# Altium project XFM2-BASE-BOARD.PrjPcb
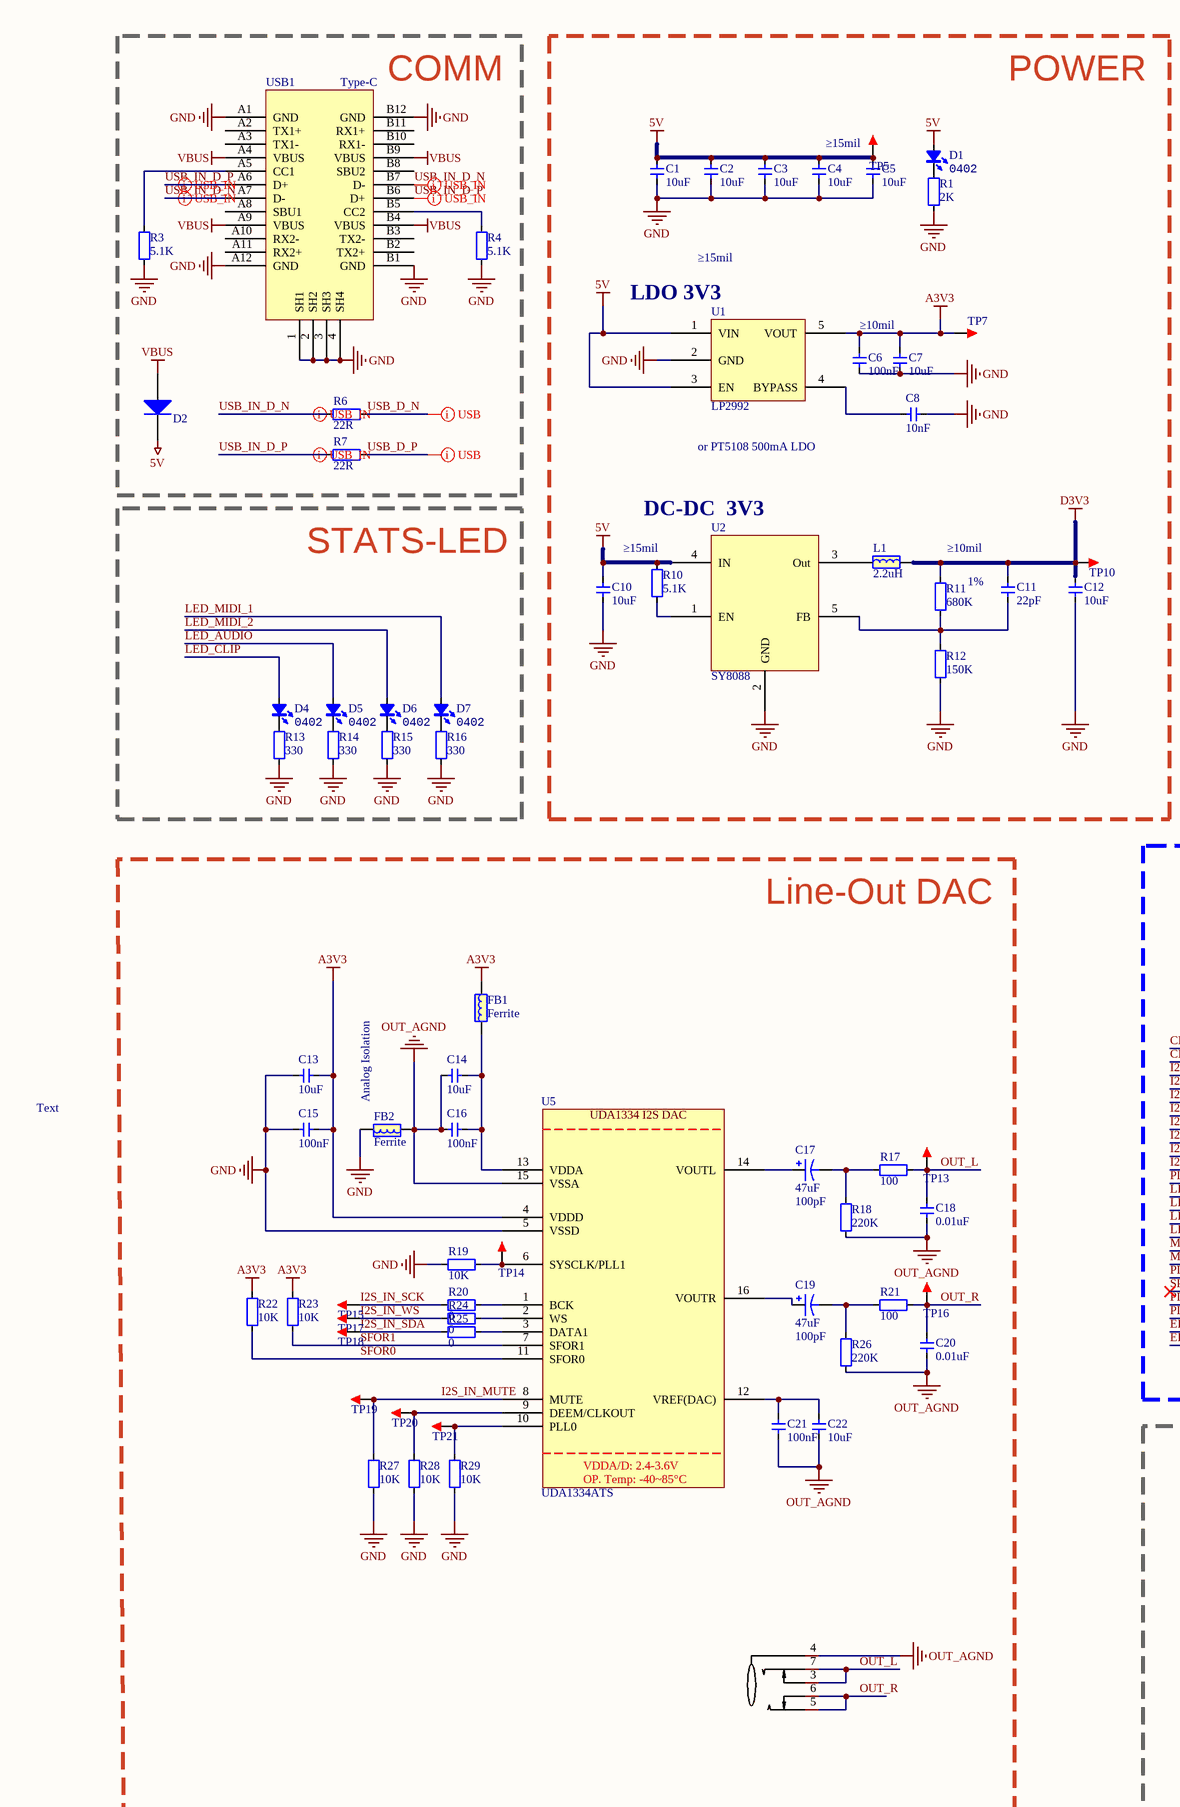
[diagram p0: Sheet1.SchDoc, left]
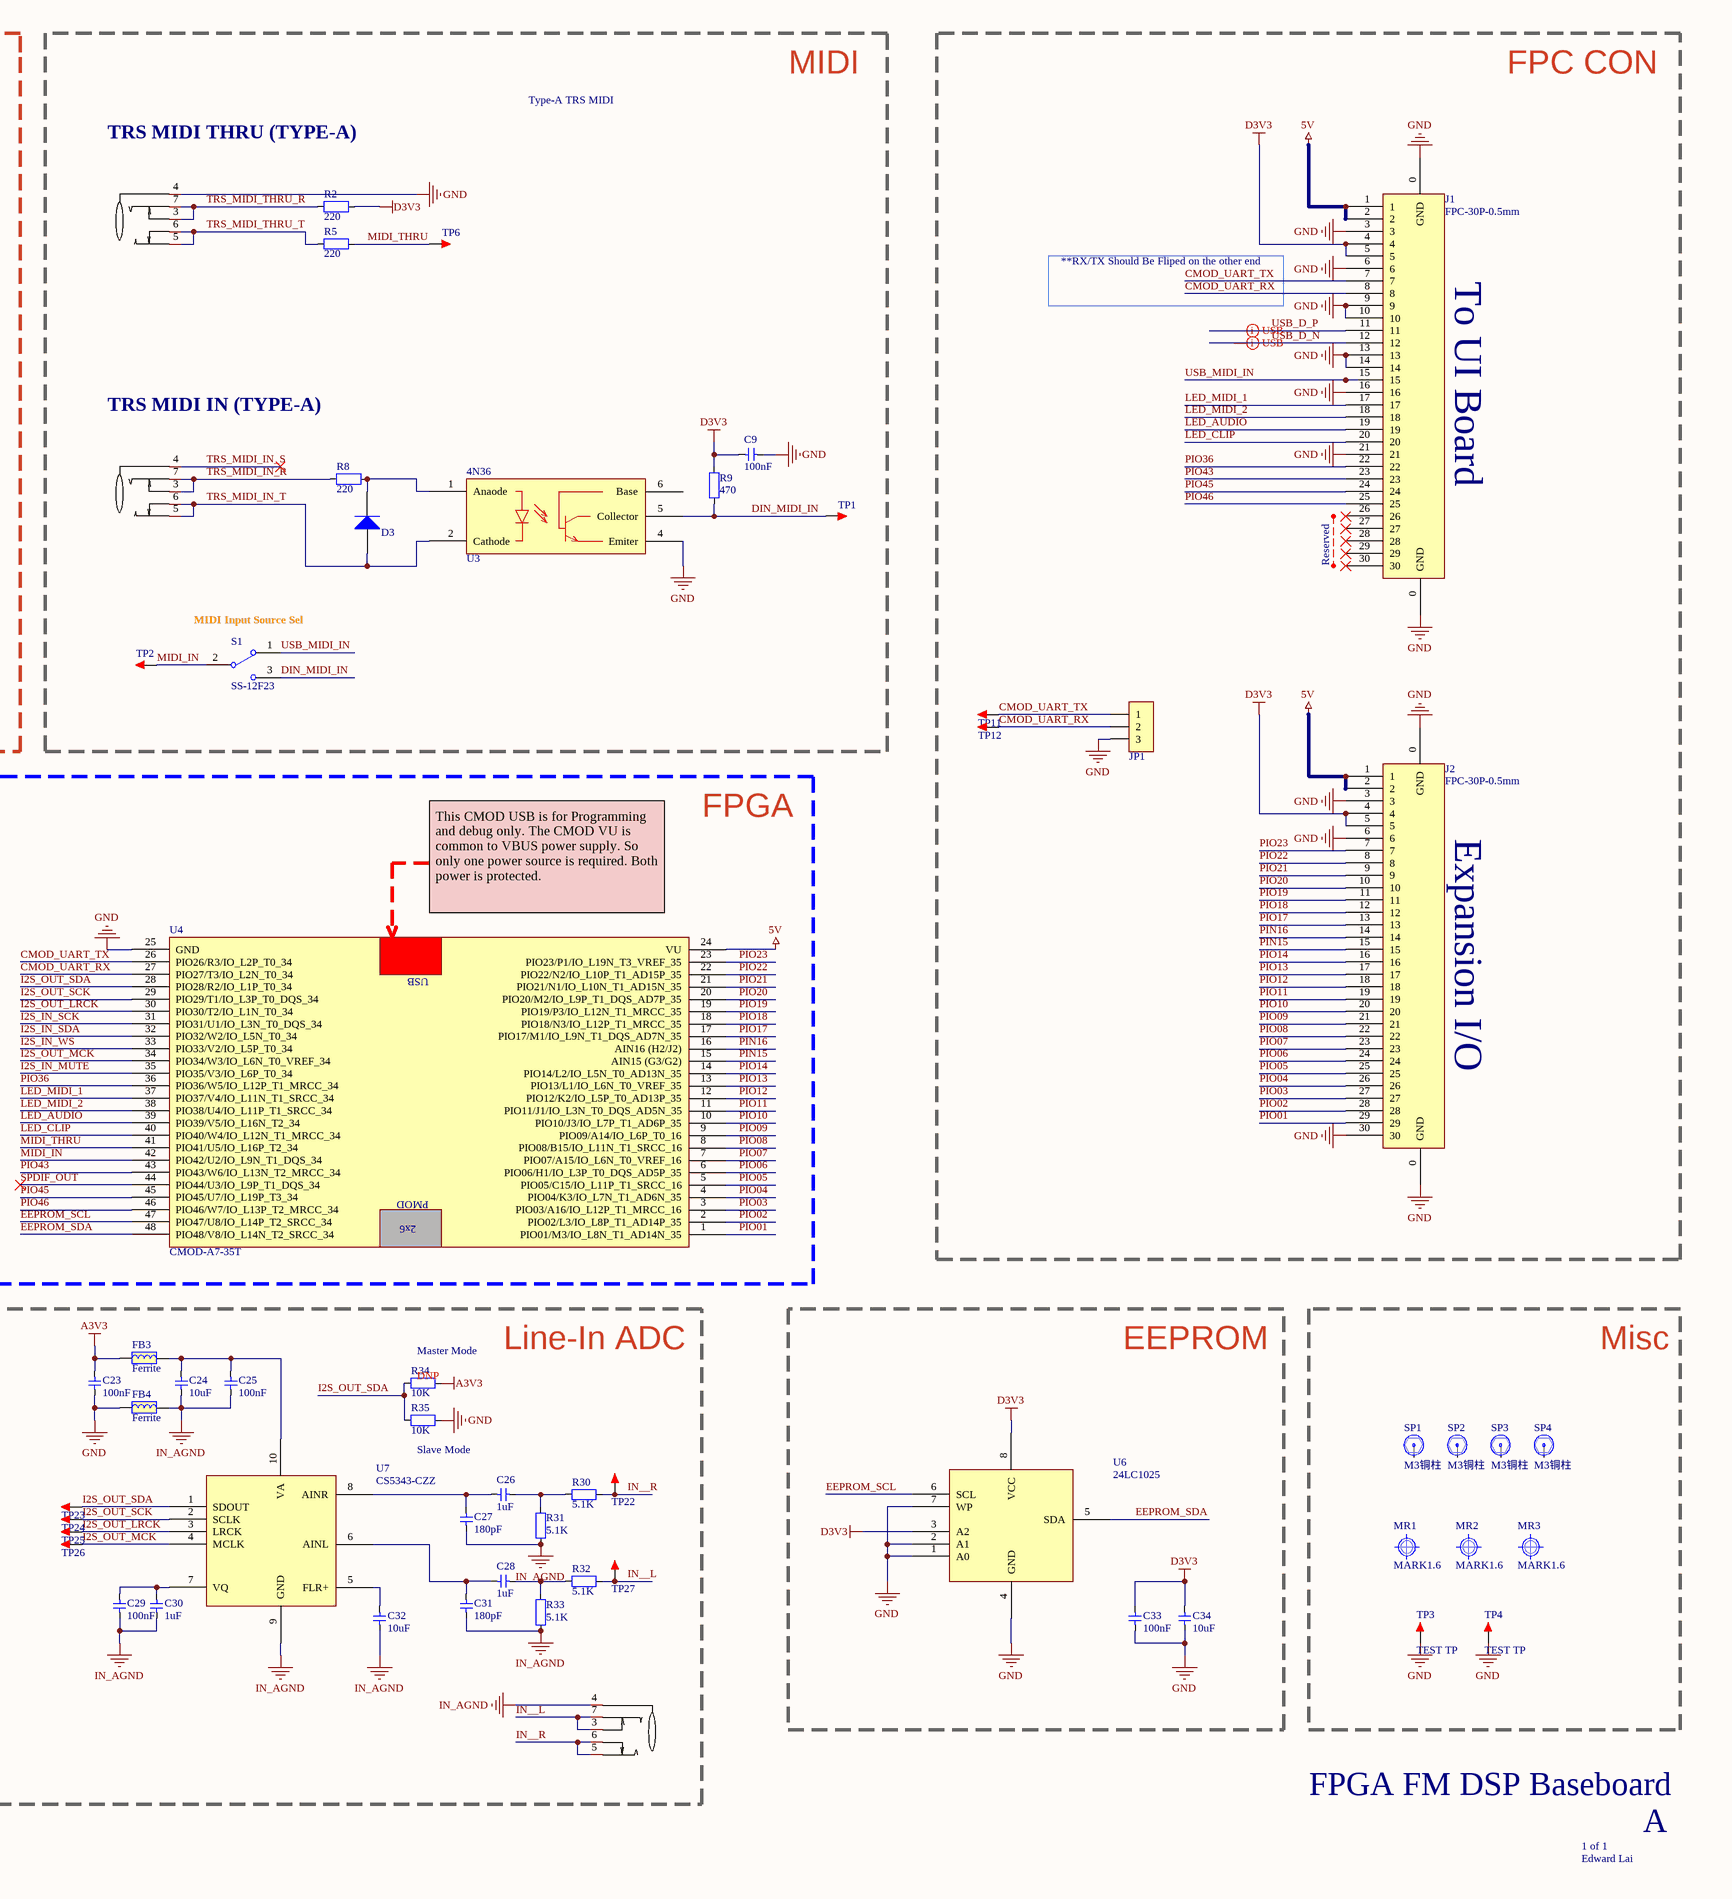
[diagram p1: Sheet1.SchDoc, right]
1 sheet, 129 parts. Net scope: global (net labels, ports and power ports of the same name join across sheets).
Board file: BaseBoard.PcbDoc

## Sheet Sheet1.SchDoc
size A2

### Parts
C1  10uF  [C0402_L]
C2  10uF  [C0402_L]
C3  10uF  [C0402_L]
C4  10uF  [C0402_L]
C5  10uF  [C0402_L]
C6  100nF  [C0402_L]
C7  10uF  [C0402_L]
C8  10nF  [C0402_L]
C9  100nF  [C0402_L]
C10  10uF  [C0402_L]
C11  22pF  [C0402_L]
C12  10uF  [C0402_L]
C13  10uF  [C0402_L]
C14  10uF  [C0402_L]
C15  100nF  [C0402_L]
C16  100nF  [C0402_L]
C17  47uF  value 100pF  [CT 5*6 - B]
C18  0.01uF  [C0603_L]
C19  47uF  value 100pF  [CT 5*6 - B]
C20  0.01uF  [C0603_L]
C21  100nF  [C0402_L]
C22  10uF  [C0402_L]
C23  100nF  [C0402_L]
C24  10uF  [C0402_L]
C25  100nF  [C0402_L]
C26  1uF  [C0402_L]
C27  180pF  [C0402_L]
C28  1uF  [C0402_L]
C29  100nF  [C0402_L]
C30  1uF  [C0402_L]
C31  180pF  [C0402_L]
C32  10uF  [C0402_L]
C33  100nF  [C0402_L]
C34  10uF  [C0402_L]
CN1  PJ-328-5A  [AUDIO-SMD_PJ-328-5A]  (value not drawn)
CN2  PJ-328-5A  [AUDIO-SMD_PJ-328-5A]  (value not drawn)
CN3  PJ-328-5A  [AUDIO-SMD_PJ-328-5A]  (value not drawn)
CN4  PJ-328-5A  [AUDIO-SMD_PJ-328-5A]  (value not drawn)
D1  Type: 0402  [LED0603_R]  (hidden comment: color?)
D2  二极管-5B5819WS  [SOD-323]  (value not drawn)
D3  Diode  [SOD-523]  (value not drawn)
D4  Type: 0402  [LED0603_R]  (hidden comment: color?)
D5  Type: 0402  [LED0603_G]  (hidden comment: color?)
D6  Type: 0402  [LED0603_W]  (hidden comment: color?)
D7  Type: 0402  [LED0603_W]  (hidden comment: color?)
FB1  Ferrite  [L0402]
FB2  Ferrite  [L0402]
FB3  Ferrite  [L0402]
FB4  Ferrite  [L0402]
J1  FPC-30P-0.5mm  [FPC0.5-WT-30P]
J2  FPC-30P-0.5mm  [FPC0.5-WT-30P]
JP1  HDR-1X3  [XH2.54-LS-3P]  (value not drawn)
L1  2.2uH  [IND-201612]
MR1  MARK1.6  [Mark 1.6]  (graphical)
MR2  MARK1.6  [Mark 1.6]  (graphical)
MR3  MARK1.6  [Mark 1.6]  (graphical)
R1  2K  [R0402_L]
R2  220  [R0402_L]
R3  5.1K  [R0402_L]
R4  5.1K  [R0402_L]
R5  220  [R0402_L]
R6  22R  [R0402_L]
R7  22R  [R0402_L]
R8  220  [R0402_L]
R9  470  [R0402_L]
R10  5.1K  [R0402_L]
R11  680K  Parameter 1: 1%  [R0402_L]
R12  150K  [R0402_L]
R13  330  [R0402_L]
R14  330  [R0402_L]
R15  330  [R0402_L]
R16  330  [R0402_L]
R17  100  [R0603_L]
R18  220K  [R0603_L]
R19  10K  [R0402_L]
R20  0  [R0402_L]
R21  100  [R0603_L]
R22  10K  [R0402_L]
R23  10K  [R0402_L]
R24  0  [R0402_L]
R25  0  [R0402_L]
R26  220K  [R0603_L]
R27  10K  [R0402_L]
R28  10K  [R0402_L]
R29  10K  [R0402_L]
R30  5.1K  [R0402_L]
R31  5.1K  [R0402_L]
R32  5.1K  [R0402_L]
R33  5.1K  [R0402_L]
R34  10K  [R0402_L]  (net tie, no BOM)
R35  10K  [R0402_L]  (net tie)
S1  SS-12F23  [MSK-12C01-07]
SP1  M3铜柱  [M3x8_N]  (graphical)
SP2  M3铜柱  [M3x8_N]  (graphical)
SP3  M3铜柱  [M3x8_N]  (graphical)
SP4  M3铜柱  [M3x8_N]  (graphical)
TP1  DIN_MIDI_IN  [TEST 1.2]  (value not drawn)
TP2  MIDI_IN  [TEST 1.2]  (value not drawn)
TP3  TEST TP  [TEST 1.2]
TP4  TEST TP  [TEST 1.2]
TP5  DIN_MIDI_IN  [TEST 1.2]  (value not drawn)
TP6  DIN_MIDI_IN  [TEST 1.2]  (value not drawn)
TP7  DIN_MIDI_IN  [TEST 1.2]  (value not drawn)
TP10  DIN_MIDI_IN  [TEST 1.2]  (value not drawn)
TP11  DIN_MIDI_IN  [TEST 1.2]  (value not drawn)
TP12  DIN_MIDI_IN  [TEST 1.2]  (value not drawn)
TP13  DIN_MIDI_IN  [TEST 1.2]  (value not drawn)
TP14  DIN_MIDI_IN  [TEST 1.2]  (value not drawn)
TP15  DIN_MIDI_IN  [TEST 1.2]  (value not drawn)
TP16  DIN_MIDI_IN  [TEST 1.2]  (value not drawn)
TP17  DIN_MIDI_IN  [TEST 1.2]  (value not drawn)
TP18  DIN_MIDI_IN  [TEST 1.2]  (value not drawn)
TP19  DIN_MIDI_IN  [TEST 1.2]  (value not drawn)
TP20  DIN_MIDI_IN  [TEST 1.2]  (value not drawn)
TP21  DIN_MIDI_IN  [TEST 1.2]  (value not drawn)
TP22  DIN_MIDI_IN  [TEST 1.2]  (value not drawn)
TP23  DIN_MIDI_IN  [TEST 1.2]  (value not drawn)
TP24  DIN_MIDI_IN  [TEST 1.2]  (value not drawn)
TP25  DIN_MIDI_IN  [TEST 1.2]  (value not drawn)
TP26  DIN_MIDI_IN  [TEST 1.2]  (value not drawn)
TP27  DIN_MIDI_IN  [TEST 1.2]  (value not drawn)
U1  LP2992  [SOT23-5M]
U2  SY8088  [SOT23-5]
U3  4N36  [OPTOCOUPLER_H11F3SR2M]
U4  CMOD-A7-35T  [DIP48]
U5  UDA1334ATS  [SSOP16]
U6  24LC1025  [SOIC-8]
U7  CS5343-CZZ  [MSOP10_M]
USB1  Type-C  [Type-C-TOP]

### Blocks framed on the sheet
COMM: D2 R3 R4 R6 R7 USB1
POWER: C1-C8 C10-C12 D1 L1 R1 R10-R12 TP5 TP7 TP10 U1 U2
MIDI: C9 CN1 CN2 D3 R2 R5 R8 R9 S1 TP1 TP2 TP6 U3
STATS-LED: D4-D7 R13-R16
FPGA: U4
Line-In ADC: C23-C32 CN4 FB3 FB4 R30-R35 TP22-TP27 U7
EEPROM: C33 C34 U6
Misc: MR1-MR3 SP1-SP4 TP3 TP4

### Nets
5V: C1.2 C2.2 C3.2 C4.2 C5.2 C10.2 D1.1(A) D2.2(K) J1.1 J1.2 J2.1 J2.2 R10.1 TP5.1 U1.1(VIN) U1.3(EN) U2.4(IN) U4.24(VU)
A3V3: C6.2 C7.2 C13.1 C15.1 C23.2 FB1.2 FB3.1 R22.1 R23.1 R34.1 TP7.1 U1.5(VOUT) U5.4(VDDD)
D3V3: C9.2 C11.2 C12.2 C33.2 C34.2 J1.4 J1.5 J2.4 J2.5 L1.2 R2.2 R9.2 R11.1 TP10.1 U6.3(A2) U6.8(VCC)
GND: C1.1 C2.1 C3.1 C4.1 C5.1 C6.1 C7.1 C8.1 C9.1 C10.1 C12.1 C13.2 C15.2 C23.1 C33.1 C34.1 CN1.4 FB2.2 FB4.1 J1.0(GND) J1.3 J1.6 J1.9 J1.10 J1.13 J1.14 J1.16 J1.21 J2.0(GND) J2.3 J2.6 J2.30 JP1.3 R1.1 R3.2 R4.2 R12.2 R13.1 R14.1 R15.1 R16.1 R19.2 R27.2 R28.2 R29.2 R35.1 TP3.1 TP4.1 U1.2(GND) U2.2(GND) U3.4(Emiter) U4.25(GND) U5.5(VSSD) U6.1(A0) U6.2(A1) U6.4(GND) U6.7(WP) USB1.1(SH1) USB1.2(SH2) USB1.3(SH3) USB1.4(SH4) USB1.A1(GND) USB1.A12(GND) USB1.B1(GND) USB1.B12(GND)
IN_AGND: C24.1 C25.1 C27.1 C29.1 C30.1 C31.1 C32.1 CN4.4 FB4.2 R31.2 R33.2 U7.9(GND)
OUT_AGND: C14.2 C16.2 C18.1 C20.1 C21.1 C22.1 CN3.4 FB2.1 R18.2 R26.2 U5.15(VSSA)
VBUS: D2.1(A) USB1.A4(VBUS) USB1.A9(VBUS) USB1.B4(VBUS) USB1.B9(VBUS)
CMOD_UART_RX: J1.8 JP1.2 TP12.1 U4.27(PIO27/T3/IO_L2N_T0_34)
CMOD_UART_TX: J1.7 JP1.1 TP11.1 U4.26(PIO26/R3/IO_L2P_T0_34)
DIN_MIDI_IN: R9.1 S1.3 TP1.1 U3.5(Collector)
EEPROM_SCL: U4.47(PIO47/U8/IO_L14P_T2_SRCC_34) U6.6(SCL)
EEPROM_SDA: U4.48(PIO48/V8/IO_L14N_T2_SRCC_34) U6.5(SDA)
I2S_IN_MUTE: R27.1 TP19.1 U4.35(PIO35/V3/IO_L6P_T0_34) U5.8(MUTE)
I2S_IN_SCK: R20.1 TP15.1 U4.31(PIO31/U1/IO_L3N_T0_DQS_34)
I2S_IN_SDA: R25.1 TP18.1 U4.32(PIO32/W2/IO_L5N_T0_34)
I2S_IN_WS: R24.1 TP17.1 U4.33(PIO33/V2/IO_L5P_T0_34)
I2S_OUT_LRCK: TP25.1 U4.30(PIO30/T2/IO_L1N_T0_34) U7.3(LRCK)
I2S_OUT_MCK: TP26.1 U4.34(PIO34/W3/IO_L6N_T0_VREF_34) U7.4(MCLK)
I2S_OUT_SCK: TP24.1 U4.29(PIO29/T1/IO_L3P_T0_DQS_34) U7.2(SCLK)
I2S_OUT_SDA: R34.2 R35.2 TP23.1 U4.28(PIO28/R2/IO_L1P_T0_34) U7.1(SDOUT)
IN__L: CN4.3 CN4.7 R32.2 TP27.1
IN__R: CN4.5 CN4.6 R30.1 TP22.1
LED_AUDIO: D5.1(A) J1.19 U4.39(PIO39/V5/IO_L16N_T2_34)
LED_CLIP: D4.1(A) J1.20 U4.40(PIO40/W4/IO_L12N_T1_MRCC_34)
LED_MIDI_1: D7.1(A) J1.17 U4.37(PIO37/V4/IO_L11N_T1_SRCC_34)
LED_MIDI_2: D6.1(A) J1.18 U4.38(PIO38/U4/IO_L11P_T1_SRCC_34)
MIDI_IN: S1.2 TP2.1 U4.42(PIO42/U2/IO_L9N_T1_DQS_34)
MIDI_THRU: R5.2 TP6.1 U4.41(PIO41/U5/IO_L16P_T2_34)
OUT_L: C18.2 CN3.3 CN3.7 R17.1 TP13.1
OUT_R: C20.2 CN3.5 CN3.6 R21.1 TP16.1
PIN15: J2.15 U4.15(AIN15_(G3/G2))
PIN16: J2.14 U4.16(AIN16_(H2/J2))
PIO01: J2.29 U4.1(PIO01/M3/IO_L8N_T1_AD14N_35)
PIO02: J2.28 U4.2(PIO02/L3/IO_L8P_T1_AD14P_35)
PIO03: J2.27 U4.3(PIO03/A16/IO_L12P_T1_MRCC_16)
PIO04: J2.26 U4.4(PIO04/K3/IO_L7N_T1_AD6N_35)
PIO05: J2.25 U4.5(PIO05/C15/IO_L11P_T1_SRCC_16)
PIO06: J2.24 U4.6(PIO06/H1/IO_L3P_T0_DQS_AD5P_35)
PIO07: J2.23 U4.7(PIO07/A15/IO_L6N_T0_VREF_16)
PIO08: J2.22 U4.8(PIO08/B15/IO_L11N_T1_SRCC_16)
PIO09: J2.21 U4.9(PIO09/A14/IO_L6P_T0_16)
PIO10: J2.20 U4.10(PIO10/J3/IO_L7P_T1_AD6P_35)
PIO11: J2.19 U4.11(PIO11/J1/IO_L3N_T0_DQS_AD5N_35)
PIO12: J2.18 U4.12(PIO12/K2/IO_L5P_T0_AD13P_35)
PIO13: J2.17 U4.13(PIO13/L1/IO_L6N_T0_VREF_35)
PIO14: J2.16 U4.14(PIO14/L2/IO_L5N_T0_AD13N_35)
PIO17: J2.13 U4.17(PIO17/M1/IO_L9N_T1_DQS_AD7N_35)
PIO18: J2.12 U4.18(PIO18/N3/IO_L12P_T1_MRCC_35)
PIO19: J2.11 U4.19(PIO19/P3/IO_L12N_T1_MRCC_35)
PIO20: J2.10 U4.20(PIO20/M2/IO_L9P_T1_DQS_AD7P_35)
PIO21: J2.9 U4.21(PIO21/N1/IO_L10N_T1_AD15N_35)
PIO22: J2.8 U4.22(PIO22/N2/IO_L10P_T1_AD15P_35)
PIO23: J2.7 U4.23(PIO23/P1/IO_L19N_T3_VREF_35)
PIO36: J1.22 U4.36(PIO36/W5/IO_L12P_T1_MRCC_34)
PIO43: J1.23 U4.43(PIO43/W6/IO_L13N_T2_MRCC_34)
PIO45: J1.24 U4.45(PIO45/U7/IO_L19P_T3_34)
PIO46: J1.25 U4.46(PIO46/W7/IO_L13P_T2_MRCC_34)
SFOR0: R22.2 U5.11(SFOR0)
SFOR1: R23.2 U5.7(SFOR1)
SPDIF_OUT: U4.44(PIO44/U3/IO_L9P_T1_DQS_34)
TRS_MIDI_IN_R: CN2.3 CN2.7 R8.1
TRS_MIDI_IN_S: CN2.4
TRS_MIDI_IN_T: CN2.5 CN2.6 D3.1(A) U3.2(Cathode)
TRS_MIDI_THRU_R: CN1.3 CN1.7 R2.1
TRS_MIDI_THRU_T: CN1.5 CN1.6 R5.1
USB_D_N: J1.12 R6.1
USB_D_P: J1.11 R7.1
USB_IN_D_N: R6.2 USB1.A7(D-) USB1.B7(D-)
USB_IN_D_P: R7.2 USB1.A6(D+) USB1.B6(D+)
USB_MIDI_IN: J1.15 S1.1
NetC8_2: C8.2 U1.4(BYPASS)
NetC11_1: C11.1 R11.2 R12.1 U2.5(FB)
NetC14_1: C14.1 C16.1 FB1.1 U5.13(VDDA)
NetC17_1: C17.1 U5.14(VOUTL)
NetC17_2: C17.2 R17.2 R18.1
NetC19_1: C19.1 U5.16(VOUTR)
NetC19_2: C19.2 R21.2 R26.1
NetC21_2: C21.2 C22.2 U5.12(VREF(DAC))
NetC24_2: C24.2 C25.2 FB3.2 U7.10(VA)
NetC26_1: C26.1 R30.2 R31.1
NetC26_2: C26.2 C27.2 U7.8(AINR)
NetC28_1: C28.1 R32.1 R33.1
NetC28_2: C28.2 C31.2 U7.6(AINL)
NetC29_2: C29.2 C30.2 U7.7(VQ)
NetC32_2: C32.2 U7.5(FLR+)
NetD1_2: D1.2(K) R1.2
NetD3_2: D3.2(K) R8.2 U3.1(Anaode)
NetD4_2: D4.2(K) R13.2
NetD5_2: D5.2(K) R14.2
NetD6_2: D6.2(K) R15.2
NetD7_2: D7.2(K) R16.2
NetL1_1: L1.1 U2.3(Out)
NetR3_1: R3.1 USB1.A5(CC1)
NetR4_1: R4.1 USB1.B5(CC2)
NetR10_2: R10.2 U2.1(EN)
NetR19_1: R19.1 TP14.1 U5.6(SYSCLK/PLL1)
NetR20_2: R20.2 U5.1(BCK)
NetR24_2: R24.2 U5.2(WS)
NetR25_2: R25.2 U5.3(DATA1)
NetR28_1: R28.1 TP20.1 U5.9(DEEM/CLKOUT)
NetR29_1: R29.1 TP21.1 U5.10(PLL0)

Not connected (* = marked no-connect by the designer): J1 26* 27* 28* 29* 30*; SP1 1; SP2 1; SP3 1; SP4 1; U3 6(Base); USB1 A2(TX1+) A3(TX1-) A8(SBU1) A10(RX2-) A11(RX2+) B2(TX2+) B3(TX2-) B8(SBU2) B10(RX1-) B11(RX1+)

### Layout directives
differential pair: USB_D_N, USB_D_P, USB_IN_D_N, USB_IN_D_P

### Notes on the sheet
- Type-A TRS MIDI
- FPC CON
- ≥15mil
- TRS MIDI THRU (TYPE-A)
- (near U1) LDO 3V3
- ≥10mil
- **RX/TX Should Be Fliped on the other end
- (near J1) To UI Board
- or PT5108 500mA LDO
- TRS MIDI IN (TYPE-A)
- DC-DC  3V3
- (near R10) ≥15mil
- Reserved
- (near S1) MIDI Input Source Sel
- Line-Out DAC
- (near J2) Expansion I/O
- (near U4) This CMOD USB is for Programming and debug only. The CMOD VU is common to VBUS power supply. So only one power source is required. Both power is protected.
- Text
- (near FB2) Analog Isolation
- (near R34) Master Mode
- (near R34) DNP
- (near R35) Slave Mode
- FPGA FM DSP Baseboard
- 1 of 1
- Edward Lai
- A
- (in symbol CMOD-A7-35T) USB; PMOD; 2x6
- (in symbol UDA1334ATS) UDA1334 I2S DAC; VDDA/D: 2.4-3.6V; OP. Temp: -40~85°C

### Library data of the parts
C1-C5 = 电容-1206: Capacitor; Value: 0.1u
C6-C16 C18 C20-C34 = 电容-0402: Capacitor; Value: 0.1u
C17 C19 = Cap Pol1: Polarized Capacitor SMT; Published: 8-Jun-2000; LatestRevisionDate: 17-Jul-2002; LatestRevisionNote: Re-released for DXP Platform.; PackageReference: RB7.6-15; Publisher: Altium Limited; PackageDescription: Polarized Capacitor (Radial); 2 Leads
CN1-CN4 = PJ-328-5A: Manufacturer: 韩国韩荣; Add into BOM: yes; Connector Type: 3.5mm耳机座; Current Rating (Max): 500mA; Voltage Rating (Max): 30V; Symbol: PJ-328-5A; Device: PJ-328-5A; Supplier: LCSC; Supplier Part: C707231; Manufacturer Part: PJ-328-5A; JLCPCB Part Class: Extended Part; LCSC Part Name: 3.5mm耳机座; Supplier Footprint: SMD; Datasheet: https://atta.szlcsc.com/upload/public/pdf/source/20210810/0B771907E8D6964D4FE913522096DF4A.pdf; Convert to PCB: yes; Operating Temperature Range: -20℃~+70℃
D1 D4-D7 = LED_0402: LED; Value: color?
D2 = 二极管-5B5817WS: 40V
D3 = Diode: 1N1418; 联系卖家，免费查找封装: 唯一出售店铺网址https://shop463601444.taobao.com; Code_JEDEC: DO-214-AB
FB1-FB4 L1 = 电感-201612
JP1 = Header 3: 3P接插件; 封装库来自淘宝卖家 ID：黄晶宝石: 其他店铺购入均为盗版假冒封装库; 联系卖家，免费查找封装: 唯一出售店铺网址https://shop463601444.taobao.com; BOM名称: 3P接插件
MR1-MR3 = MARK: 光学定位点; 联系卖家，免费查找封装: 唯一出售店铺网址https://shop463601444.taobao.com; 封装库来自淘宝卖家ID：黄晶宝石: 其他店铺购入均为盗版假冒封装库，请立即申请退款; BOM名称: 光学定位点
R1-R5 R8-R35 = 电阻-0402: Resistor; Value: 22R
R6 R7 = 电阻-0402: Resistor; Value: 22R
S1 = SSW-1P: 1路波动开关; BOM名称: 波动开关; 联系卖家，免费查找封装: 唯一出售店铺网址https://shop463601444.taobao.com; 封装库来自淘宝卖家ID：黄晶宝石: 其他店铺购入均为盗版假冒封装库，请立即申请退款
SP1-SP4 = 铜柱大焊盘: 铜柱; 联系卖家，免费查找封装: 唯一出售店铺网址https://shop463601444.taobao.com; 封装库来自淘宝卖家ID：黄晶宝石: 其他店铺购入均为盗版假冒封装库，请立即申请退款; BOM名称: 铜柱
TP1-TP7 TP10-TP27 = TEST TP: 测试环; 联系卖家，免费查找封装: 唯一出售店铺网址https://shop463601444.taobao.com; 封装库来自淘宝卖家ID：黄晶宝石: 其他店铺购入均为盗版假冒封装库，请立即申请退款; BOM名称: 测试环
U2 = SY8088: SY8088 High Efficiency 1.5MHz, 1A / Synchronous Step Down Regulator
U3 = 4N36: 4N36 / 6-Pin General Purpose Phototransistor Optocouplers
U4 = CMOD-A7-35T: Digilent CMOD A7 35T
U6 = 24LC1025: 24LC1025 EEPROM
U7 = CS5343-CZZ: 98dB 96kHz Multi-Bit Audio ADC
USB1 = USB-Type-C-TOP